# EAGLE design NoWaterNoNo (EAGLE 6.5.0)
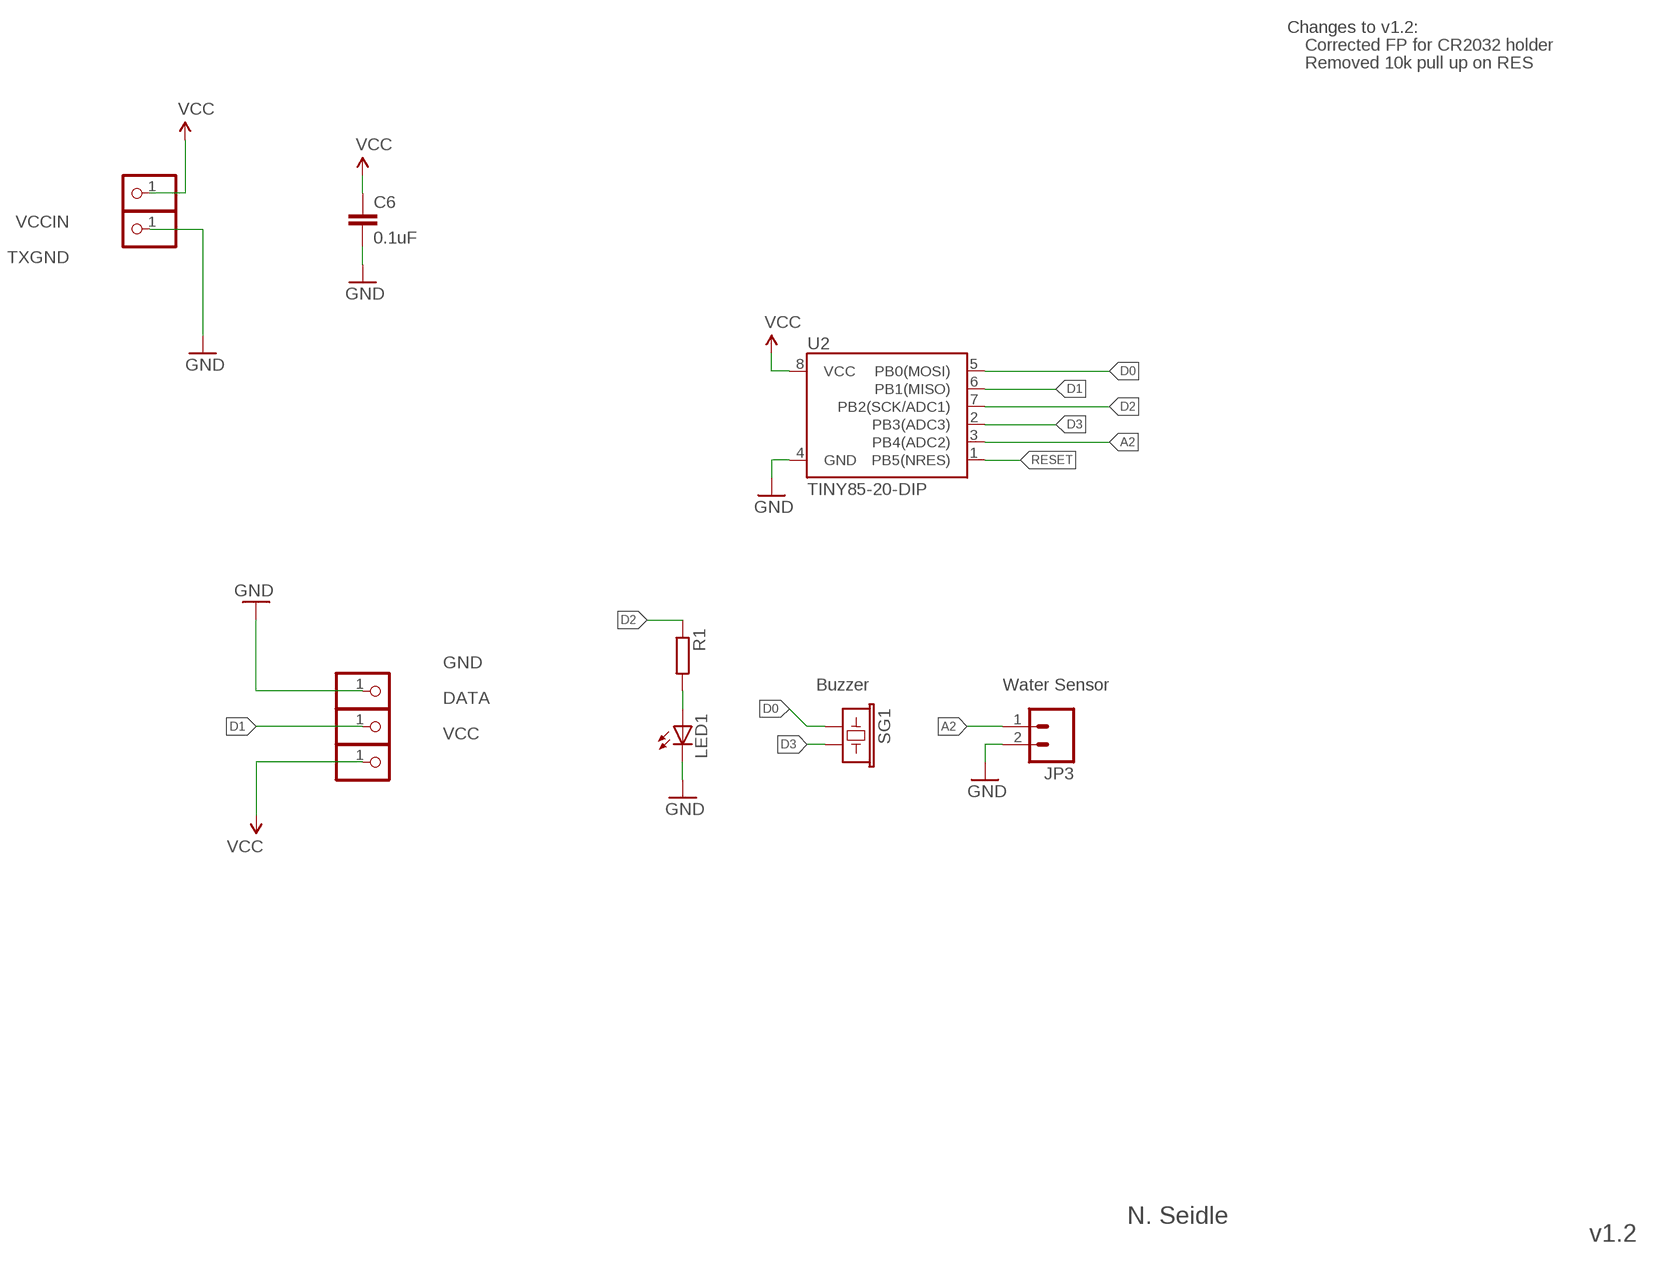
[diagram p0: schematic, sheet 1]

## Parts
C6  0.1uF  CAPPTH2  [CAP-PTH-SMALL2]
DATA  PINHD-1X1  [1X01]
GND  PINHD-1X1  [1X01]
JP3  Water Sensor  M02PTH  [1X02]
LED1  LED5MM  [LED5MM]
R1  R-EU_0204/2V  [0204V]
SG1  Buzzer  BUZZERPTH  [BUZZER-12MM]
TXGND  PINHD-1X1  [1X01]
U2  TINY85-20-DIP  ATTINY45TINY85-20-DIP  [DIP08]
VCC  PINHD-1X1  [1X01]
VCCIN  PINHD-1X1  [1X01]

## Nets
A2: JP3.1 U2.3(PB4(ADC2))
D0: SG1.+ U2.5(PB0(MOSI))
D1: DATA.1 U2.6(PB1(MISO))
D2: R1.1 U2.7(PB2(SCK/ADC1))
D3: SG1.- U2.2(PB3(ADC3))
GND: C6.2 GND.1 JP3.2 LED1.K(C) TXGND.1 U2.4(GND)
N$1: LED1.A R1.2
RESET: U2.1(PB5(NRES))
VCC: C6.1 U2.8(VCC) VCC.1 VCCIN.1

## Notes on the sheet
- Changes to v1.2:
- Corrected FP for CR2032 holder
- Removed 10k pull up on RES
- N. Seidle
- v1.2

## Library data of the parts
C6 = SparkFun:CAP: Capacitor Standard 0603 ceramic capacitor, and 0.1" leaded capacitor.
DATA GND TXGND VCC VCCIN = pinhead:PINHD-1X1: PIN HEADER
JP3 = SparkFun-Connectors:M02: Standard 2-pin 0.1" header. Use with - straight break away headers ( PRT-00116) - right angle break away headers (PRT-00553) - swiss pins (PRT-00743) - machine pins (PRT-00117) - female headers (PRT-00115) Molex polarized connector foot print use with: PRT-08233 with associated crimp pins and housings. 2.54_SCREWTERM for use with PRT-10571. 3.5mm Screw Terminal footprints for PRT-08084 5mm Screw Terminal footprints for use with PRT-08433
LED1 = SparkFun-LED:LED: LEDs Standard schematic elements and footprints for 5mm, 3mm, 1206, and 0603 sized LEDs. 5mm - Spark Fun Electronics SKU : COM-00529 (and others)
R1 = rcl:R-EU_: RESISTOR, European symbol
SG1 = SparkFun-Electromechanical:BUZZER: Buzzer 12mm Spark Fun Electronics SKU : Comp-Buzzer
U2 = SparkFun-DigitalIC:ATTINY45: Atmel 8-pin 2/4/8kB flash uC; PROD_ID: IC-09445

## Board
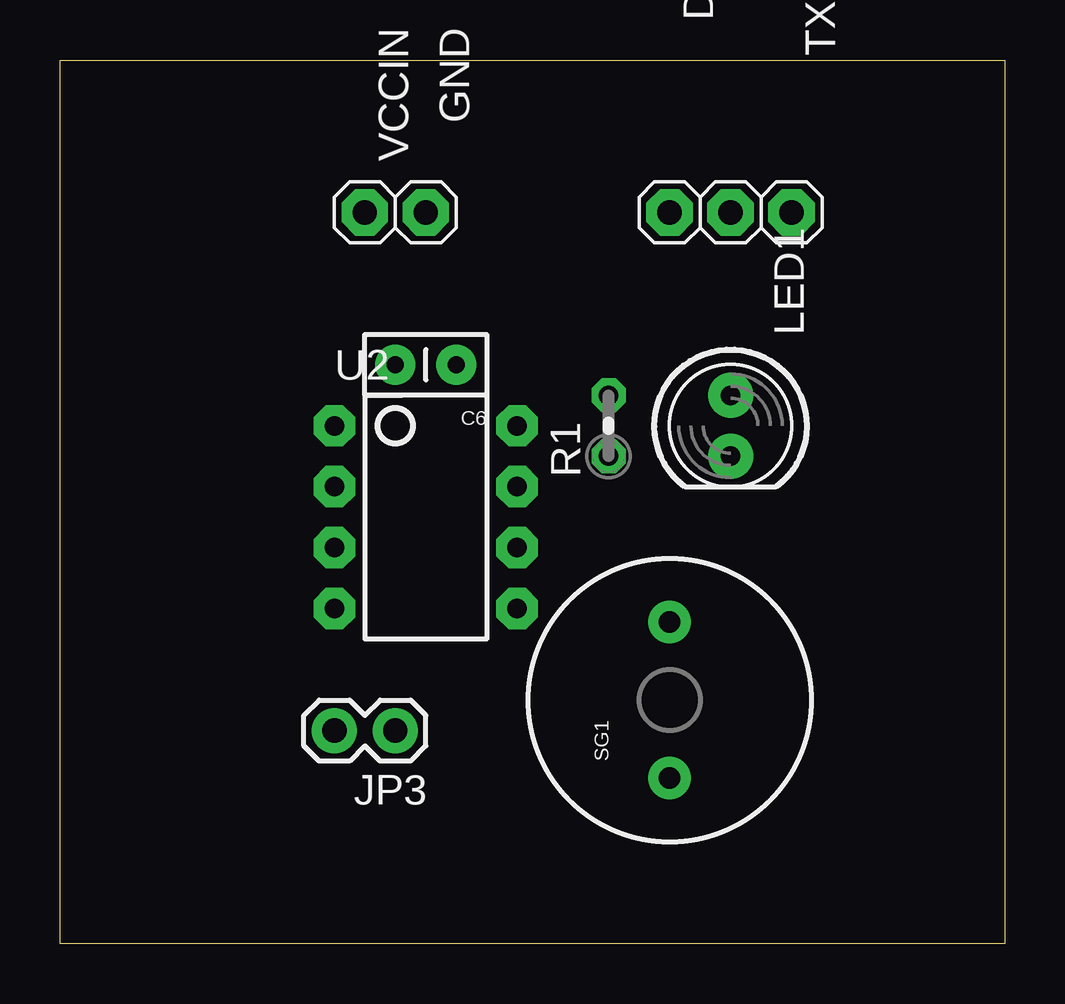
[diagram p1: board, top side]
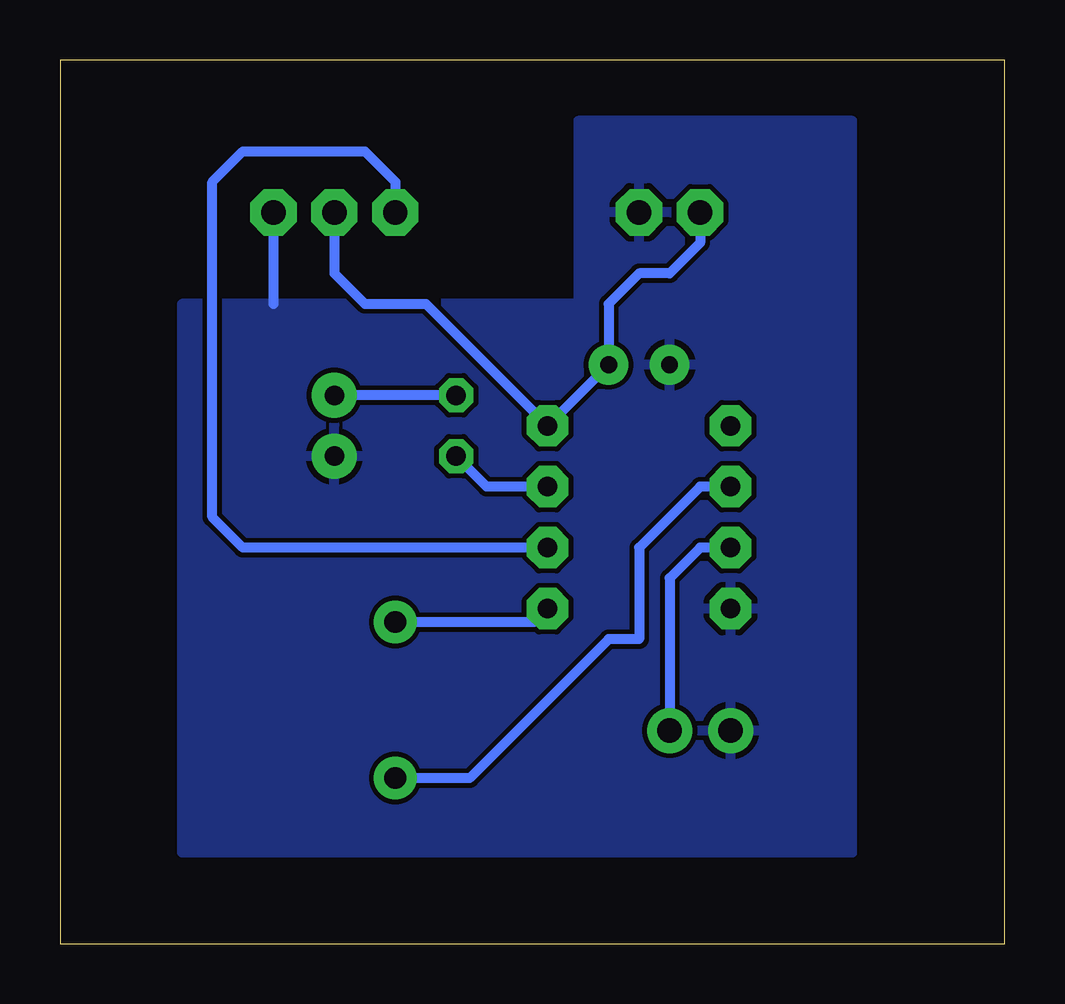
[diagram p2: board, bottom side, seen from below]

Size 39.37 x 36.83 mm. Coordinates in mm from the lower left corner, seen from the top.
Outline: 0,36.83 39.37,36.83 39.37,0 0,0 0,36.83
Copper layers (1*16): Top 0.035mm / dielectric 1.5mm / Bottom 0.035mm
Design rules "SparkFun": minimum track width 8mil, minimum drill 20mil, track to track 8mil, track to pad 8mil, pad to pad 8mil, via to via 8mil, smd to smd 8mil, copper to edge 10mil, drill to drill 8mil, minimum pad ring 12mil, minimum via ring 10mil, stop-mask expansion 4mil, vias tented up to drill 25mil, thermal gap 10mil

### Footprints (pad centres in the part's own frame; a part is rotated, then mirrored left to right if it is on the bottom)
CAP-PTH-SMALL2 = drill 0.7 pad 1.651: 1 0,0; 2 2.54,0
1X01 = drill 1.016 pad 1.93 octagon: 1 0,0
1X02 = drill 1.016 pad 1.88: 1 0,0; 2 2.54,0
LED5MM = drill 0.813 pad 1.88: A -1.27,0; K 1.27,0
0204V = drill 0.813 octagon: 1 -1.27,0; 2 1.27,0
BUZZER-12MM = drill 0.9 pad 1.778: + 3.25,0; - -3.25,0
DIP08 = drill 0.813 pad 1.727 octagon: 1 -3.81,-3.81; 2 -1.27,-3.81; 3 1.27,-3.81; 4 3.81,-3.81; 5 3.81,3.81; 6 1.27,3.81; 7 -1.27,3.81; 8 -3.81,3.81

### Placement (x,y rotation side)
C6  16.51,24.13 180 top
DATA  25.4,30.48 270 top
GND  15.24,30.48 270 top
JP3  13.97,8.89 180 top
LED1  27.94,21.59 270 top
R1  22.86,21.59 90 top
SG1  25.4,10.16 90 top
TXGND  30.48,30.48 270 top
U2  15.24,17.78 270 top
VCC  27.94,30.48 270 top
VCCIN  12.7,30.48 0 top

### Tracks (layer width: path | path; a pad name or v marks a point on that pad's centre or on a via)
A2
  Bottom 0.406: U2.3 12.7,16.51 13.97,15.24 JP3.1
D0
  Bottom 0.406: U2.5 19.61,13.41 SG1.+
D1
  Bottom 0.406: U2.6 31.75,16.51 33.02,17.78 33.02,31.75 31.75,33.02 26.67,33.02 25.4,31.75 DATA.1
D2
  Bottom 0.406: U2.7 21.59,19.05 R1.1
D3
  Bottom 0.406: U2.2 12.7,19.05 15.24,16.51 15.24,12.7 16.51,12.7 22.3,6.91 SG1.-
GND
  Bottom 0.406: TXGND.1 30.48,26.67
  pour Bottom: 34.29,26.67 34.29,3.81 6.35,3.81 6.35,26.67
  pour Bottom: 6.35,24.13 6.35,34.29 17.78,34.29 17.78,24.13
N$1
  Bottom 0.406: R1.2 LED1.A
VCC
  Bottom 0.406: VCCIN.1 12.7,29.21 13.97,27.94 15.24,27.94 16.51,26.67 C6.1 U2.8 24.13,26.67 26.67,26.67 27.94,27.94 VCC.1

### Text on the board
Document: N. Seidle